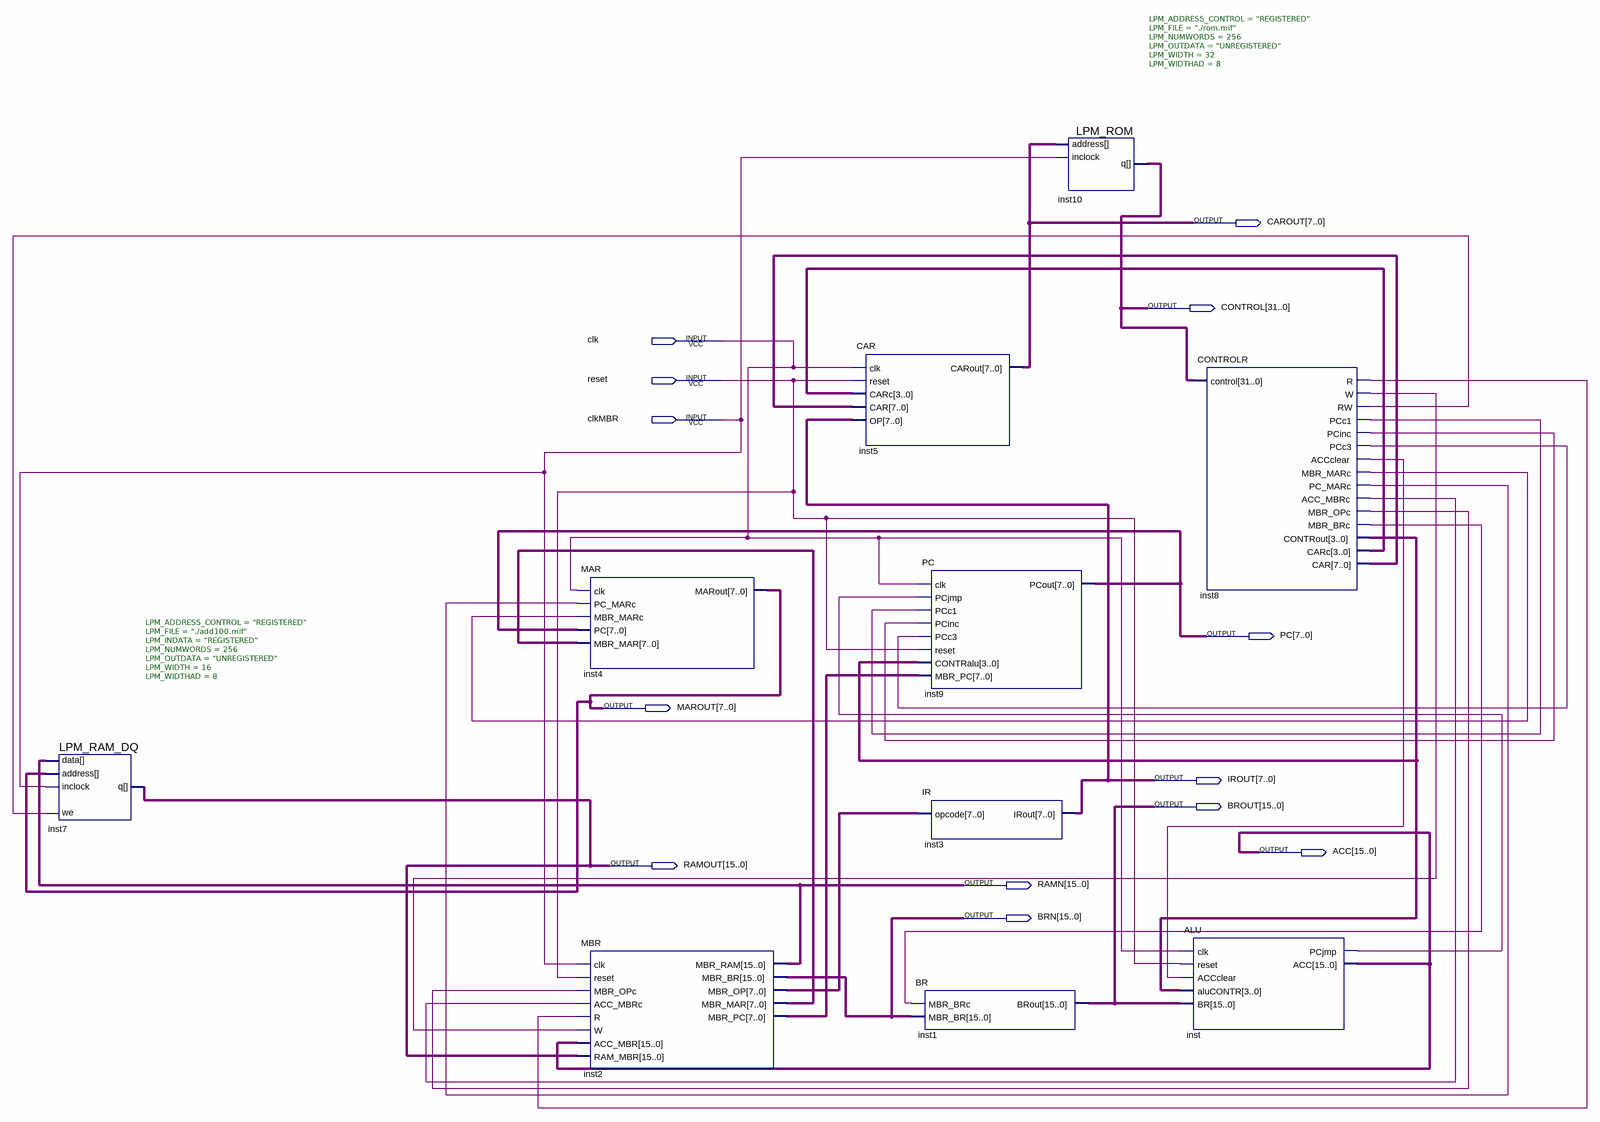
[diagram p0: schematic sheet]
// Quartus schematic zjh_f4b.bdf as structural Verilog: 10 symbols, 13 pins
module zjh_f4b (
  input  clk,
  input  reset,
  input  clkMBR,
  output [7:0] CAROUT,
  output [31:0] CONTROL,
  output [7:0] PC,
  output [7:0] MAROUT,
  output [7:0] IROUT,
  output [15:0] BROUT,
  output [15:0] ACC,
  output [15:0] RAMOUT,
  output [15:0] RAMN,
  output [15:0] BRN
);

  wire inst8_acc_mbrc, inst8_accclear, inst8_mbr_brc, inst8_mbr_marc, inst8_mbr_opc, inst8_pc_marc,
       inst8_pcc1, inst8_pcc3, inst8_pcinc, inst8_r, inst8_rw, inst8_w, inst_pcjmp;
  wire [3:0] inst8_carc, inst8_controut;
  wire [7:0] inst2_mbr_mar, inst2_mbr_op, inst2_mbr_pc, inst8_car;

  LPM_RAM_DQ #(.LPM_ADDRESS_CONTROL("REGISTERED"), .LPM_FILE("./add100.mif"), .LPM_INDATA("REGISTERED"), .LPM_NUMWORDS(256), .LPM_OUTDATA("UNREGISTERED"), .LPM_WIDTH(16), .LPM_WIDTHAD(8)) inst7 (
    .address(MAROUT), .data(RAMN), .inclock(clkMBR), .we(inst8_rw), .q(RAMOUT));
  MAR inst4 (
    .clk(clk), .PC_MARc(inst8_pc_marc), .MBR_MARc(inst8_mbr_marc), .PC(PC), .MBR_MAR(inst2_mbr_mar),
    .MARout(MAROUT));
  MBR inst2 (
    .clk(clkMBR), .reset(reset), .MBR_OPc(inst8_mbr_opc), .ACC_MBRc(inst8_acc_mbrc), .R(inst8_r),
    .W(inst8_w), .ACC_MBR(ACC), .RAM_MBR(RAMOUT), .MBR_RAM(RAMN), .MBR_BR(BRN), .MBR_OP(inst2_mbr_op),
    .MBR_MAR(inst2_mbr_mar), .MBR_PC(inst2_mbr_pc));
  CAR inst5 (.clk(clk), .reset(reset), .CARc(inst8_carc), .CAR(inst8_car), .OP(IROUT), .CARout(CAROUT));
  PC inst9 (
    .clk(clk), .PCjmp(inst_pcjmp), .PCc1(inst8_pcc1), .PCinc(inst8_pcinc), .PCc3(inst8_pcc3), .reset(reset),
    .CONTRalu(inst8_controut), .MBR_PC(inst2_mbr_pc), .PCout(PC));
  IR inst3 (.opcode(inst2_mbr_op), .IRout(IROUT));
  BR inst1 (.MBR_BRc(inst8_mbr_brc), .MBR_BR(BRN), .BRout(BROUT));
  LPM_ROM #(.LPM_ADDRESS_CONTROL("REGISTERED"), .LPM_FILE("./rom.mif"), .LPM_NUMWORDS(256), .LPM_OUTDATA("UNREGISTERED"), .LPM_WIDTH(32), .LPM_WIDTHAD(8)) inst10 (
    .address(CAROUT), .inclock(clkMBR), .q(CONTROL));
  ALU inst (
    .clk(clk), .reset(reset), .ACCclear(inst8_accclear), .aluCONTR(inst8_controut), .BR(BROUT),
    .PCjmp(inst_pcjmp), .ACC(ACC));
  CONTROLR inst8 (
    .control(CONTROL), .R(inst8_r), .W(inst8_w), .RW(inst8_rw), .PCc1(inst8_pcc1), .PCinc(inst8_pcinc),
    .PCc3(inst8_pcc3), .ACCclear(inst8_accclear), .MBR_MARc(inst8_mbr_marc), .PC_MARc(inst8_pc_marc),
    .ACC_MBRc(inst8_acc_mbrc), .MBR_OPc(inst8_mbr_opc), .MBR_BRc(inst8_mbr_brc), .CONTRout(inst8_controut),
    .CARc(inst8_carc), .CAR(inst8_car));
endmodule
